# EAGLE schematic board (EAGLE 9.2.2)

## Sheet 1 of 4: MCU and Motors
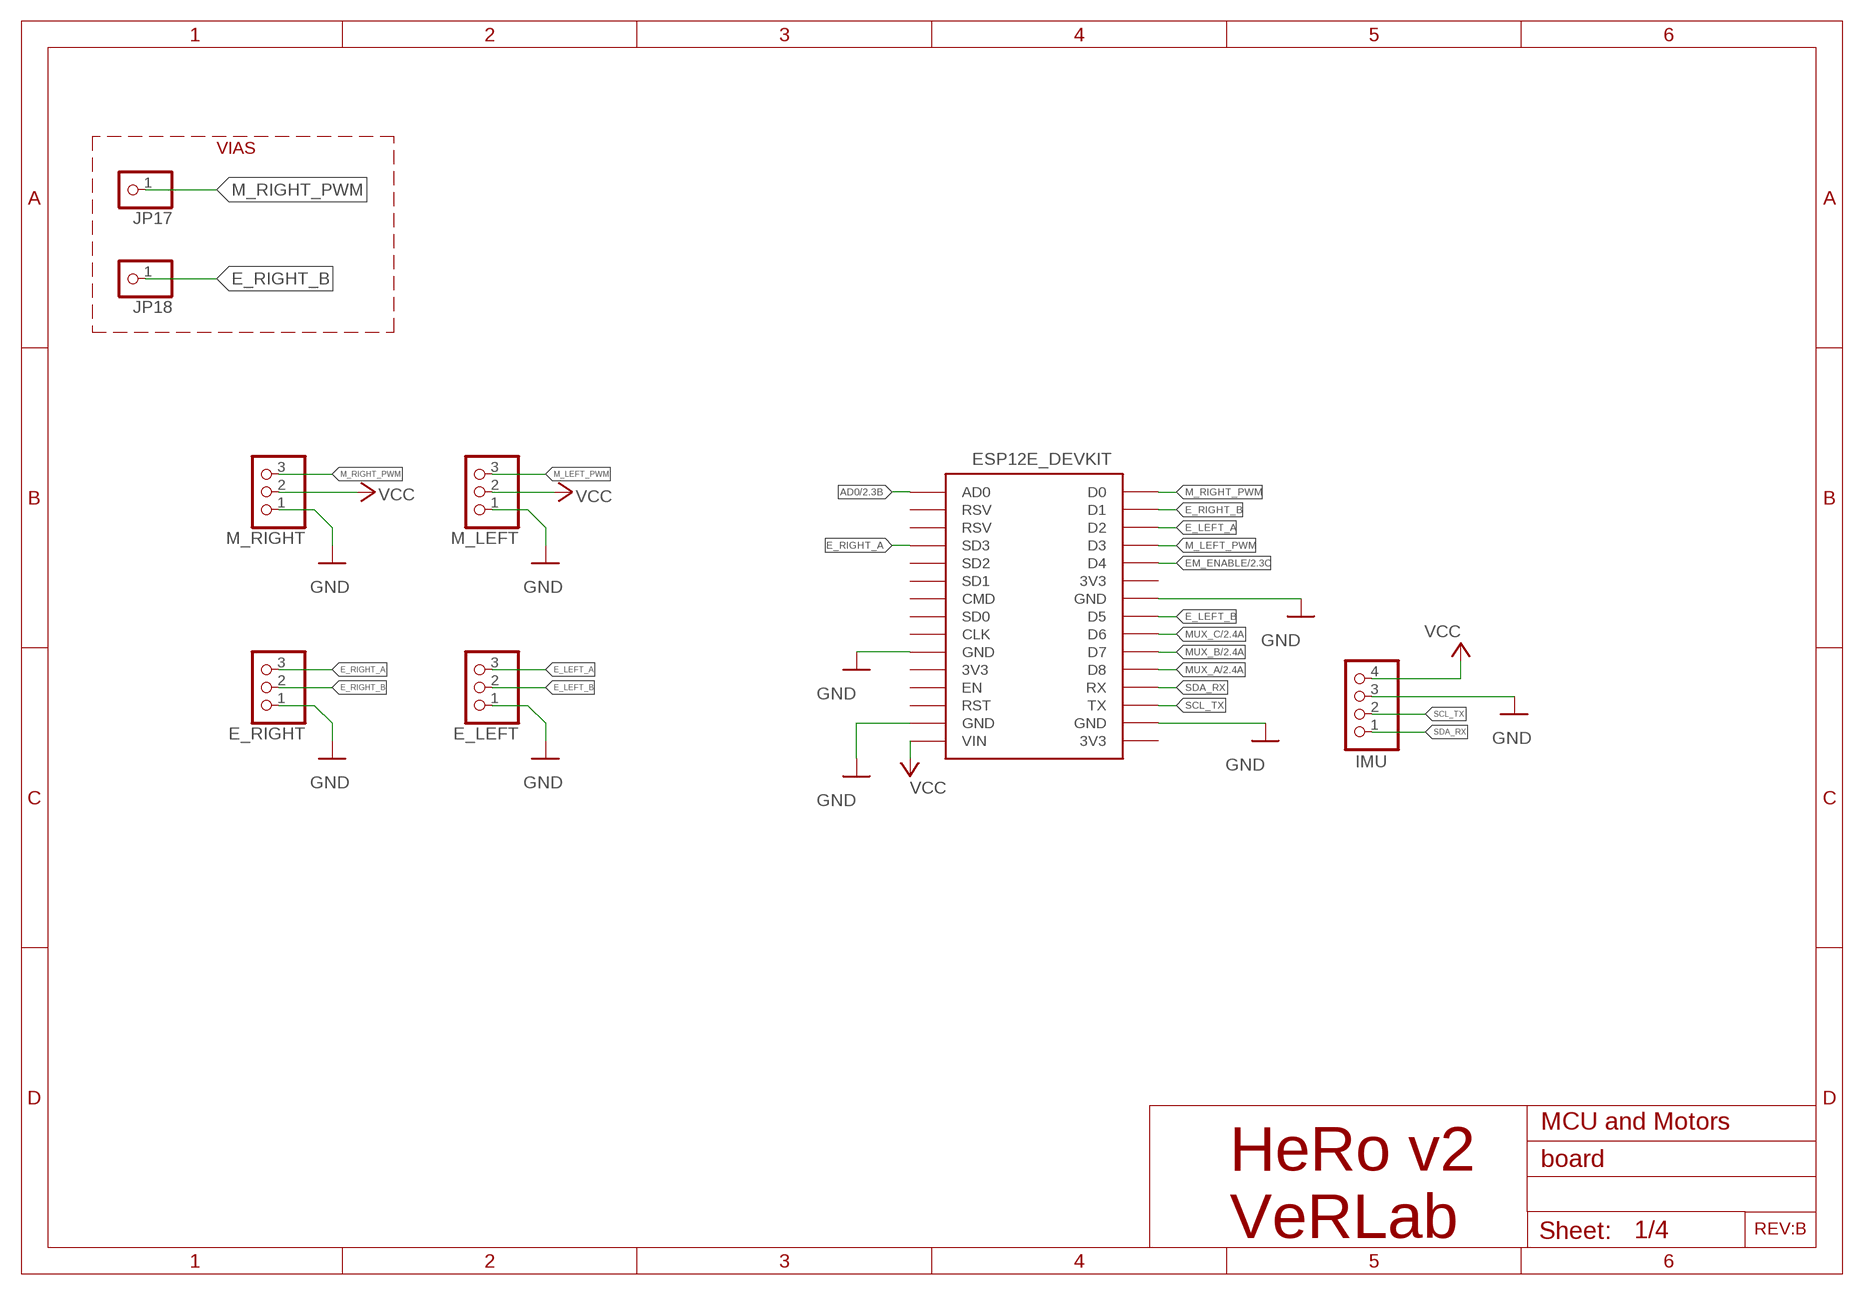
[diagram p0: schematic, sheet 1]
FRAME2 (A4L-LOC): TITLE: MCU and Motors

### Parts
E_LEFT  PINHD-1X3  [1X03]
E_RIGHT  PINHD-1X3  [1X03]
IMU  PINHD-1X4  [1X04]
JP17  PINHD-1X1  [1X01]
JP18  PINHD-1X1  [1X01]
M_LEFT  PINHD-1X3  [1X03]
M_RIGHT  PINHD-1X3  [1X03]
U$1  ESP12E_DEVKIT  [ESP12E_DEVKIT]

### Nets
AD0: U$1.AD0 ; also sheet 2
E_LEFT_A: E_LEFT.3 U$1.D2
E_LEFT_B: E_LEFT.2 U$1.D5
E_RIGHT_A: E_RIGHT.3 U$1.SD3
E_RIGHT_B: E_RIGHT.2 JP18.1 U$1.D1
EM_ENABLE: U$1.D4 ; also sheet 2,3
GND [gnd]: E_LEFT.1 E_RIGHT.1 IMU.3 M_LEFT.1 M_RIGHT.1 U$1.GND@0(GND) U$1.GND@1(GND) U$1.GND@2(GND) U$1.GND@3(GND) ; also sheet 2,3,4
M_LEFT_PWM: M_LEFT.3 U$1.D3
M_RIGHT_PWM: JP17.1 M_RIGHT.3 U$1.D0
MUX_A: U$1.D8 ; also sheet 2
MUX_B: U$1.D7 ; also sheet 2
MUX_C: U$1.D6 ; also sheet 2
SCL_TX: IMU.2 U$1.TX
SDA_RX: IMU.1 U$1.RX
VCC: IMU.4 M_LEFT.2 M_RIGHT.2 U$1.VIN ; also sheet 2,3,4
Unconnected: U$1.3V3@0(3V3) U$1.3V3@1(3V3) U$1.3V3@2(3V3) U$1.CLK U$1.CMD U$1.EN U$1.RST U$1.RSV@0(RSV) U$1.RSV@1(RSV) U$1.SD0 U$1.SD1 U$1.SD2

### Notes on the sheet
- VIAS
- REV:B
- HeRo v2
  VeRLab

## Sheet 2 of 4: Proximity Sensors
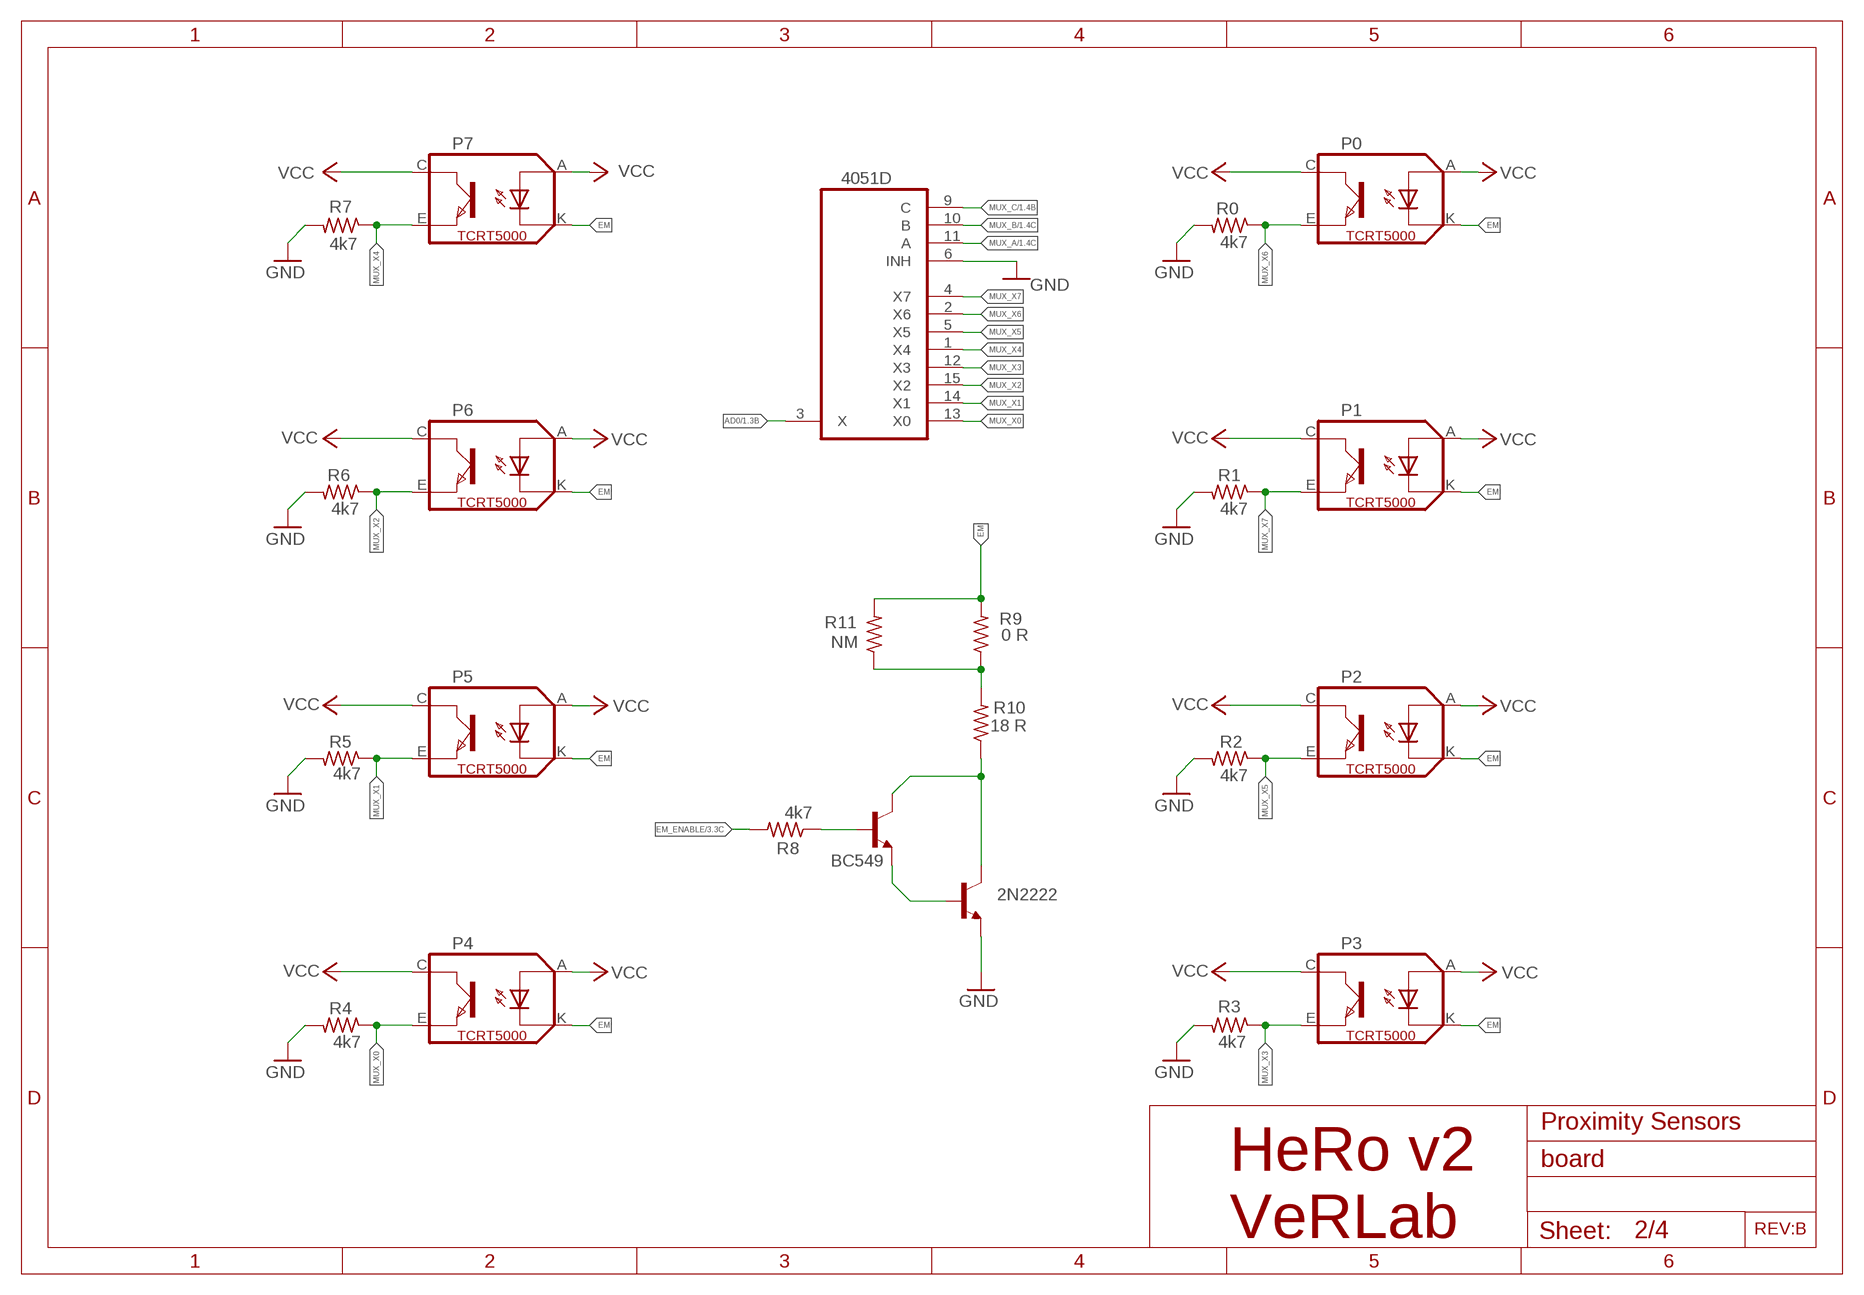
[diagram p1: schematic, sheet 2]
FRAME1 (A4L-LOC): TITLE: Proximity Sensors

### Parts
BC549  BC549-NPN-TO92-CBE  [TO92-CBE]
IC2  4051D  [SO16]
P0  TCRT5000  [TCRT5000]
P1  TCRT5000  [TCRT5000]
P2  TCRT5000  [TCRT5000]
P3  TCRT5000  [TCRT5000]
P4  TCRT5000  [TCRT5000]
P5  TCRT5000  [TCRT5000]
P6  TCRT5000  [TCRT5000]
P7  TCRT5000  [TCRT5000]
R0  4k7  R-US_M0805  [M0805]
R1  4k7  R-US_M0805  [M0805]
R2  4k7  R-US_M0805  [M0805]
R3  4k7  R-US_M0805  [M0805]
R4  4k7  R-US_M0805  [M0805]
R5  4k7  R-US_M0805  [M0805]
R6  4k7  R-US_M0805  [M0805]
R7  4k7  R-US_M0805  [M0805]
R8  4k7  R-US_R0805  [R0805]
R9  0 R  R-US_R0805  [R0805]
R10  18 R  R-US_R0805  [R0805]
R11  NM  R-US_R0805  [R0805]
T5  2N2222  [TO92-EBC-OVAL]

### Nets
AD0: IC2.3(X) ; also sheet 1
EM: P0.K(CATHODE) P1.K(CATHODE) P2.K(CATHODE) P3.K(CATHODE) P4.K(CATHODE) P5.K(CATHODE) P6.K(CATHODE) P7.K(CATHODE) R9.2 R11.2
EM_ENABLE: R8.2 ; also sheet 1,3
EM_ENABLE_RES: BC549.B R8.1
GND [gnd]: IC2.6(INH) R0.2 R1.2 R2.2 R3.2 R4.2 R5.2 R6.2 R7.2 T5.E ; also sheet 1,3,4
MUX_A: IC2.11(A) ; also sheet 1
MUX_B: IC2.10(B) ; also sheet 1
MUX_C: IC2.9(C) ; also sheet 1
MUX_X0: IC2.13(X0) P4.E(EMITTER) R4.1
MUX_X1: IC2.14(X1) P5.E(EMITTER) R5.1
MUX_X2: IC2.15(X2) P6.E(EMITTER) R6.1
MUX_X3: IC2.12(X3) P3.E(EMITTER) R3.1
MUX_X4: IC2.1(X4) P7.E(EMITTER) R7.1
MUX_X5: IC2.5(X5) P2.E(EMITTER) R2.1
MUX_X6: IC2.2(X6) P0.E(EMITTER) R0.1
MUX_X7: IC2.4(X7) P1.E(EMITTER) R1.1
N$4: R9.1 R10.2 R11.1
N$6: BC549.C R10.1 T5.C
N$7: BC549.E T5.B
VCC: P0.A(ANODE) P0.C(COLLECTOR) P1.A(ANODE) P1.C(COLLECTOR) P2.A(ANODE) P2.C(COLLECTOR) P3.A(ANODE) P3.C(COLLECTOR) P4.A(ANODE) P4.C(COLLECTOR) P5.A(ANODE) P5.C(COLLECTOR) P6.A(ANODE) P6.C(COLLECTOR) P7.A(ANODE) P7.C(COLLECTOR) ; also sheet 1,3,4

### Notes on the sheet
- REV:B
- HeRo v2
  VeRLab

## Sheet 3 of 4: LED RGB
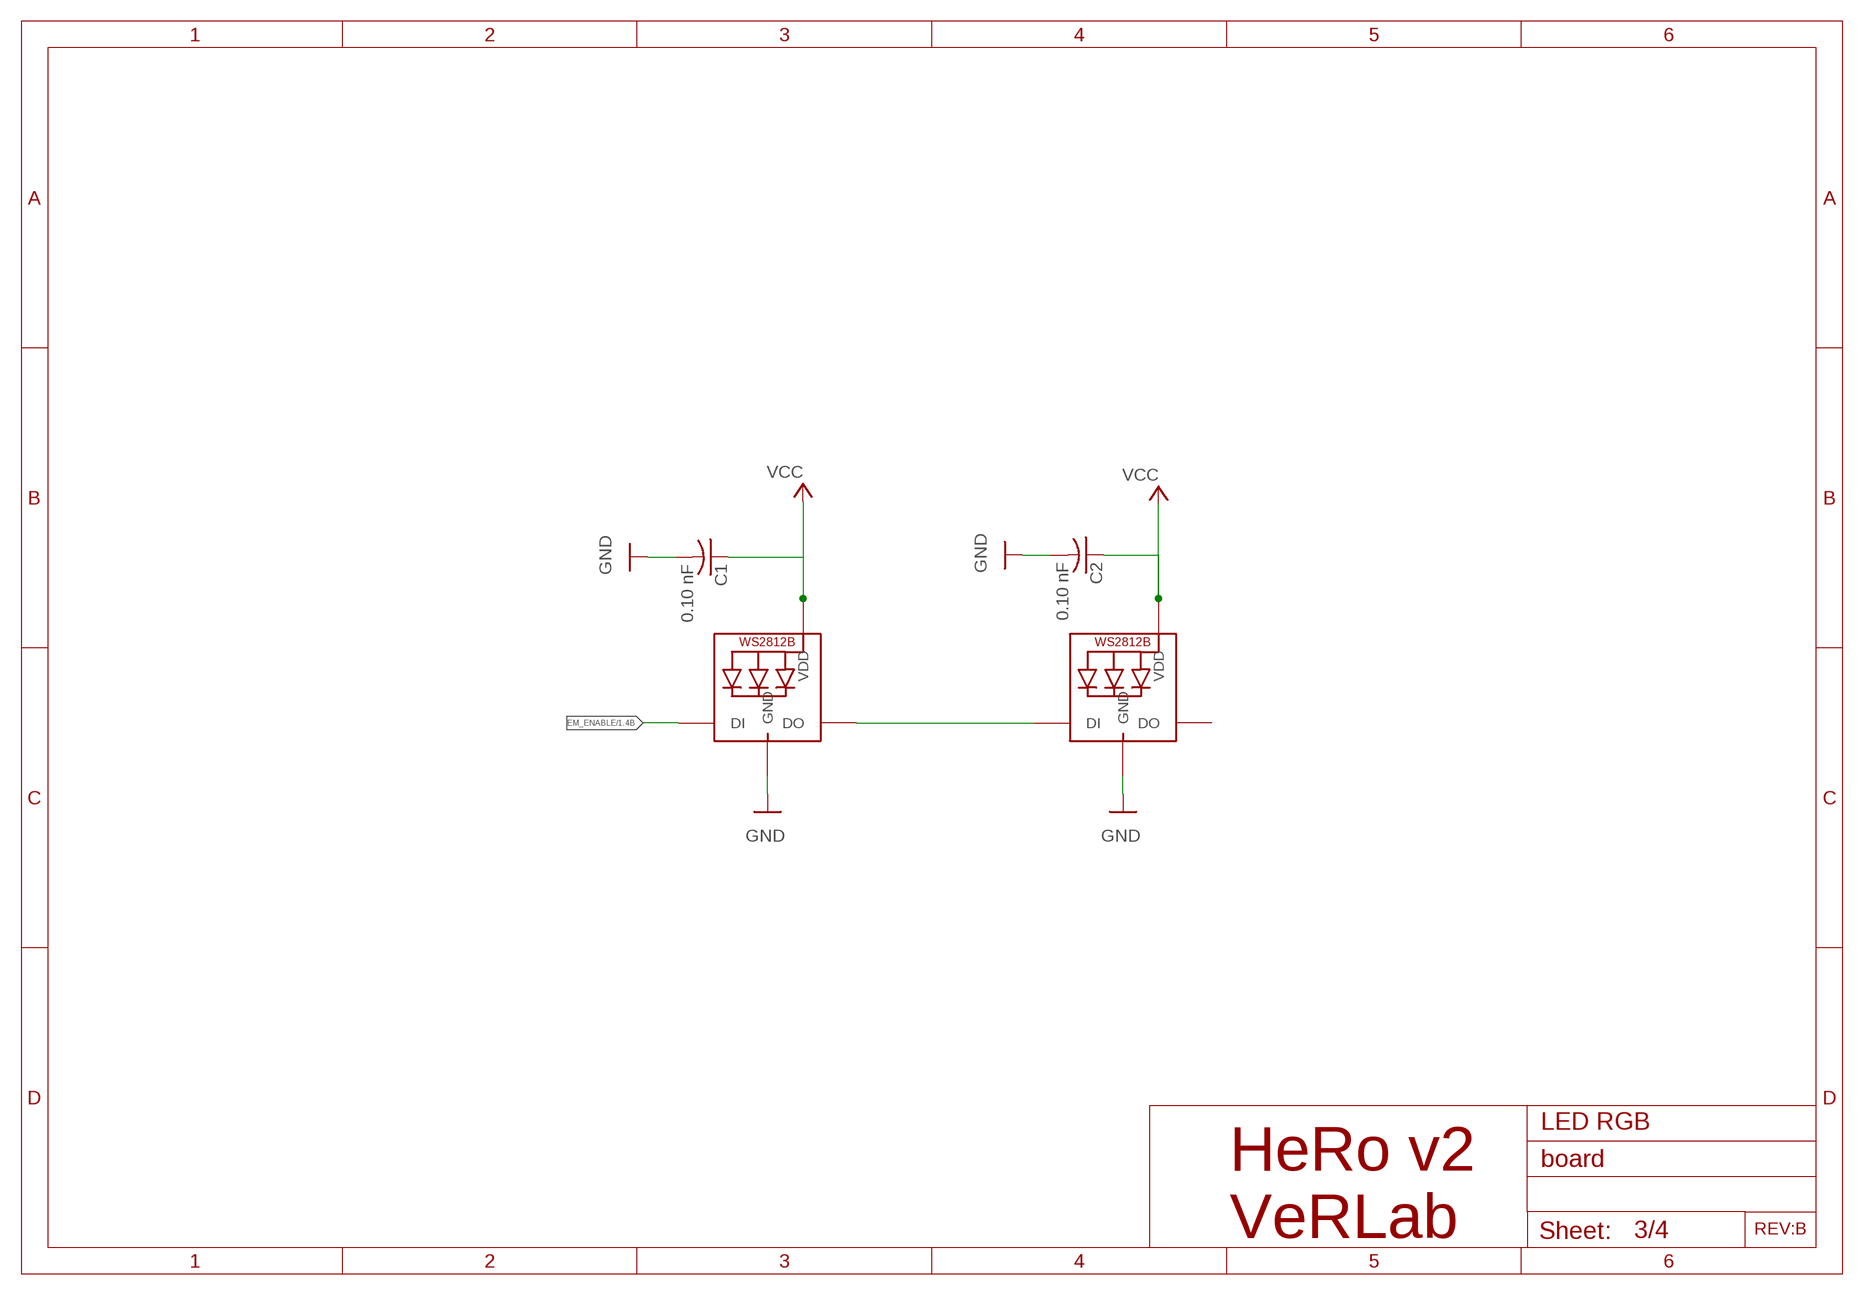
[diagram p2: schematic, sheet 3]
FRAME3 (A4L-LOC): TITLE: LED RGB

### Parts
C1  0.10 nF  C-USC0603  [C0603]
C2  0.10 nF  C-USC0603  [C0603]
LED3  WS2812B5050  [WS2812B]
LED4  WS2812B5050  [WS2812B]

### Nets
EM_ENABLE: LED3.4-DIN(DI) ; also sheet 1,2
GND [gnd]: C1.2 C2.2 LED3.3-GND(GND) LED4.3-GND(GND) ; also sheet 1,2,4
VCC: C1.1 C2.1 LED3.1-VDD(VDD) LED4.1-VDD(VDD) ; also sheet 1,2,4
WS_OUT: LED3.2-DOUT(DO) LED4.4-DIN(DI)
Unconnected: LED4.2-DOUT(DO)

### Notes on the sheet
- REV:B
- HeRo v2
  VeRLab

## Sheet 4 of 4: Power Supply
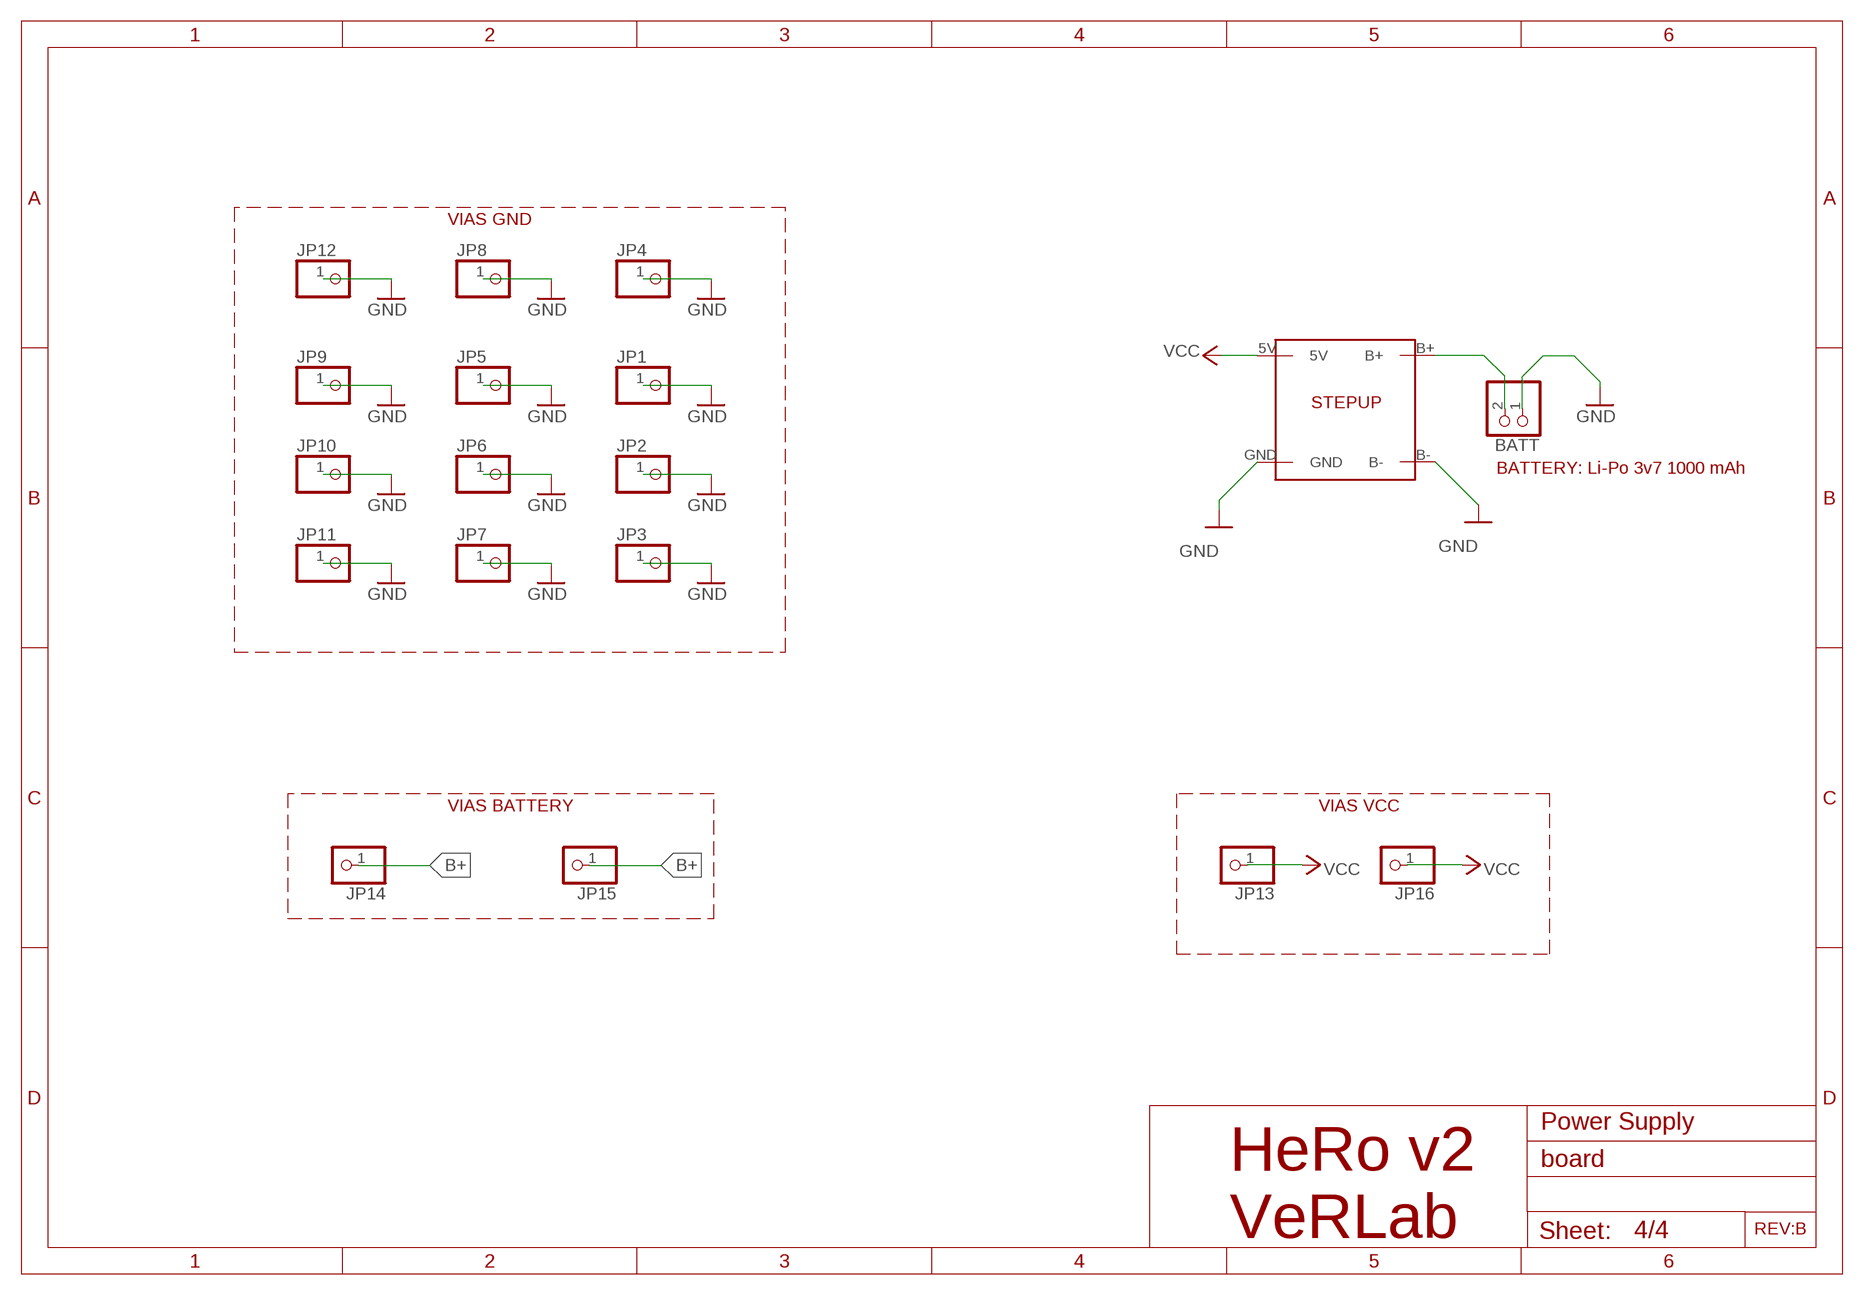
[diagram p3: schematic, sheet 4]
FRAME4 (A4L-LOC): TITLE: Power Supply

### Parts
BATT  PINHD-1X2  [1X02]
JP1  PINHD-1X1  [1X01]
JP2  PINHD-1X1  [1X01]
JP3  PINHD-1X1  [1X01]
JP4  PINHD-1X1  [1X01]
JP5  PINHD-1X1  [1X01]
JP6  PINHD-1X1  [1X01]
JP7  PINHD-1X1  [1X01]
JP8  PINHD-1X1  [1X01]
JP9  PINHD-1X1  [1X01]
JP10  PINHD-1X1  [1X01]
JP11  PINHD-1X1  [1X01]
JP12  PINHD-1X1  [1X01]
JP13  PINHD-1X1  [1X01]
JP14  PINHD-1X1  [1X01]
JP15  PINHD-1X1  [1X01]
JP16  PINHD-1X1  [1X01]
OS1  STEPUP  [STEPUP]

### Nets
B+: BATT.2 JP14.1 JP15.1 OS1.B+
GND [gnd]: BATT.1 JP1.1 JP2.1 JP3.1 JP4.1 JP5.1 JP6.1 JP7.1 JP8.1 JP9.1 JP10.1 JP11.1 JP12.1 OS1.B- OS1.GND ; also sheet 1,2,3
VCC: JP13.1 JP16.1 OS1.5V ; also sheet 1,2,3

### Notes on the sheet
- VIAS GND
- BATTERY: Li-Po 3v7 1000 mAh
- VIAS BATTERY | VIAS VCC
- REV:B
- HeRo v2
  VeRLab

## Power pins joined to a net without a drawn wire
GND: IC2.8(GND)
VCC: IC2.16(VCC)
VEE: IC2.7(VEE)

## Library data of the parts
BATT = pinhead:PINHD-1X2: PIN HEADER
BC549 = transistor:*-NPN-: NPN Transistror BF959 corrected 2008.03.06; SPICEPREFIX: J
C1 C2 = adafruit:C-US: CAPACITOR, American symbol
E_LEFT E_RIGHT M_LEFT M_RIGHT = pinhead:PINHD-1X3: PIN HEADER
IC2 = 40xx:4051: 8-channel ANALOG MULTIPLEXER
IMU = pinhead:PINHD-1X4: PIN HEADER
JP1-JP18 = adafruit:PINHD-1X1: Pin header 1x1 for 0.1" spacing With round pins
LED3 LED4 = adafruit:WS2812B
OS1 = stepup:STEPUP
P0 P1-P7 = tcrt5000:TCRT5000
R0 R1-R7 = adafruit:R-US_: RESISTOR, American symbol
R8-R11 = resistor:R-US_: RESISTOR, American symbol; SPICEPREFIX: R
T5 = adafruit:2N2222: NPN TRANSISTOR Big oval pads; SPICEPREFIX: J
U$1 = ESP12E_DEVKIT:ESP12E_DEVKIT: ESP12E DEVKIT BOARD

## Net classes
0 default: width 0.508 mm, drill 0.508 mm, clearance 0.254 mm
1 gnd: width 2.54 mm, drill 0.508 mm, clearance 0.203 mm